# EAGLE design POE_Power_Supply (EAGLE 9.6.2)
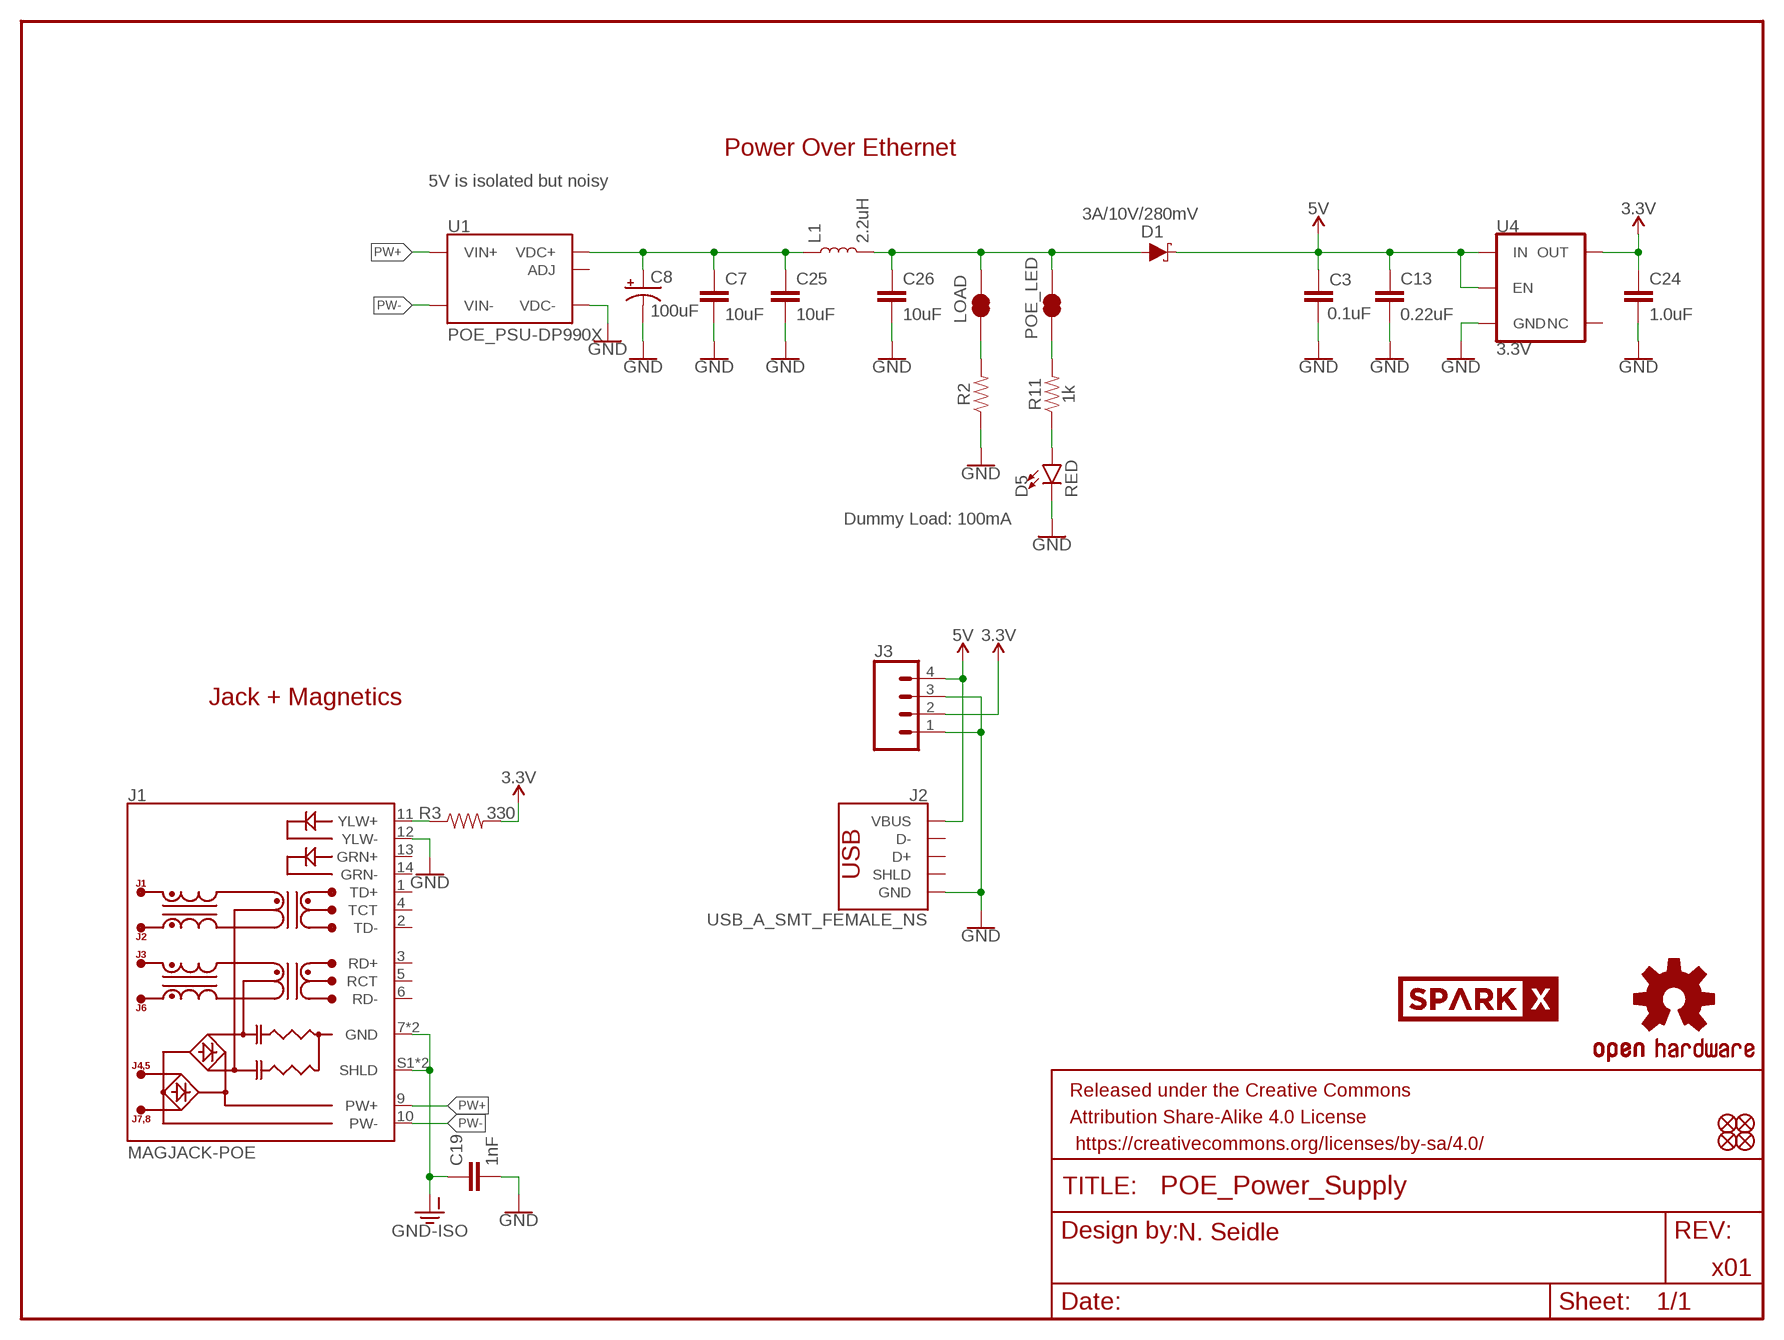
[diagram p0: schematic, sheet 1]

## Parts
C3  0.1uF  0.1UF-0603-25V-(+80/-20%)  [0603]
C7  10uF  10UF-0805-25V-10%  [0805]
C8  100uF  100UF-POLAR-25V-20%(ELEC)  [PANASONIC_D]
C13  0.22uF  0.22UF-0603-25V-10%  [0603]
C19  1nF  1.0NF/1000PF-1206-2KV-10%  [1206]
C24  1.0uF  1.0UF-0603-16V-10%-X7R  [0603]
C25  10uF  10UF-0805-25V-10%  [0805]
C26  10uF  10UF-0805-25V-10%  [0805]
D1  3A/10V/280mV  DIODE-SCHOTTKY-BAT60A  [SOD-323]
D5  RED  LED-RED0603  [LED-0603]
FD1  FIDUCIALUFIDUCIAL  [FIDUCIAL-MICRO]
FD2  FIDUCIALUFIDUCIAL  [FIDUCIAL-MICRO]
FD3  FIDUCIALUFIDUCIAL  [FIDUCIAL-MICRO]
FD4  FIDUCIALUFIDUCIAL  [FIDUCIAL-MICRO]
FRAME1  FRAME-LETTER  [CREATIVE_COMMONS]
J1  MAGJACK-POE  [MAGJACK-SYM_LED]
J2  USB_A_SMT_FEMALE_NS  [USB-A-S-NOSILK-FEMALE]
J3  CONN_041X04_NO_SILK  [1X04_NO_SILK]
L1  2.2uH  INDUCTOR-0805_WIDE-2.2UH  [0805-WIDE]
LOAD  JUMPER-SMT_2_NC_TRACE_SILK  [SMT-JUMPER_2_NC_TRACE_SILK]
LOGO3  OSHW-LOGOMINI  [OSHW-LOGO-MINI]
POE_LED  JUMPER-SMT_2_NC_TRACE_SILK  [SMT-JUMPER_2_NC_TRACE_SILK]
R2  49.9OHM-1206-1/2W-1%  [1206]
R3  330  330OHM-0603-1/10W-1%  [0603]
R11  1k  1KOHM-0603-1/10W-1%  [0603]
U1  POE_PSU-DP990X  [DP990X]
U4  3.3V  V_REG_AP2112K-3.3V  [SOT23-5]
U$7  SPARKX-LOGO4  [SPARKX-MEDIUM]

## Nets
3.3V: C24.1 J3.2 R3.2 U4.5(OUT)
5V: C3.1 C13.1 D1.C J2.VBUS J3.4 U4.1(IN) U4.3(EN)
5V_FILTER: C26.1 D1.A L1.2 LOAD.2 POE_LED.2
5V_RAW: C7.1 C8.+ C25.1 L1.1 U1.1(VDC+) U1.2(VDC+)
GND: C3.2 C7.2 C8.- C13.2 C19.2 C24.2 C25.2 C26.2 D5.C J1.12(YLW-) J2.GND J3.1 J3.3 R2.1 U1.3(VDC-) U4.2(GND)
GND-ISO: C19.1 J1.7(GND) J1.8(GND) J1.S1(SHLD) J1.S2(SHLD)
N$5: D5.A R11.1
N$6: POE_LED.1 R11.2
N$9: LOAD.1 R2.2
N$10: J1.11(YLW+) R3.1
PW+: J1.9(PW+) U1.5(VIN+) U1.6(VIN+)
PW-: J1.10(PW-) U1.7(VIN-) U1.8(VIN-)
Unconnected: J1.1(TD+) J1.2(TD-) J1.3(RD+) J1.4(TCT) J1.5(RCT) J1.6(RD-) J1.13(GRN+) J1.14(GRN-) J2.D+ J2.D- J2.SHLD1(SHLD) J2.SHLD2(SHLD) U1.4(ADJ) U4.4(NC)

## Notes on the sheet
- Power Over Ethernet
- 5V is isolated but noisy
- Dummy Load: 100mA
- Jack + Magnetics
- N. Seidle
- x01

## Library data of the parts
C3 = SparkFun-Capacitors:0.1UF: 0.1µF ceramic capacitors A capacitor is a passive two-terminal electrical component used to store electrical energy temporarily in an electric field.; PROD_ID: CAP-00810
C7 C25 C26 = SparkFun-Capacitors:10UF: 10.0µF ceramic capacitors A capacitor is a passive two-terminal electrical component used to store electrical energy temporarily in an electric field.; PROD_ID: CAP-14259
C8 = SparkFun-Capacitors:100UF-POLAR: 100µF polarized capacitors A capacitor is a passive two-terminal electrical component used to store electrical energy temporarily in an electric field.; PROD_ID: CAP-12547
C13 = SparkFun-Capacitors:0.22UF: 0.22µF ceramic capacitors A capacitor is a passive two-terminal electrical component used to store electrical energy temporarily in an electric field.; PROD_ID: CAP-07822
C19 = SparkFun-Capacitors:1.0NF/1000PF: 1nF/1,000pF ceramic capacitors A capacitor is a passive two-terminal electrical component used to store electrical energy temporarily in an electric field.; PROD_ID: CAP-16238
C24 = SparkFun-Capacitors:1.0UF: 1µF ceramic capacitors A capacitor is a passive two-terminal electrical component used to store electrical energy temporarily in an electric field.; PROD_ID: CAP-13930
D1 = SparkFun-DiscreteSemi:DIODE-SCHOTTKY: Schottky diode A Schottky diode is a semiconductor diode which has a low forward voltage drop and a very fast switching action.; PROD_ID: DIO-14072
D5 = SparkFun-LED:LED-RED: Red SMD LED Used in manufacturing of most products at SparkFun Packages: 0603 - SMD 0603 package [Product Link] <http://docs.avagotech.com/docs/AV02-0551EN> 0603 SMART - SMD 0603 SMART package ( more efficient and expensive)[Product Link] <http://www.osram-os.com/Graphics/XPic2/00077099_0.pdf> 1206 - SMD1206 package [Product Link] <https://www.sparkfun.com/datasheets/DevTools/LilyPad/Q150OVS4.pdff> SparkFun Products: Pro Mini 328 -5V <https://www.sparkfun.com/products/821> RedBoard <https://www.sparkfun.com/products/12757> IOIO-OTG <https://www.sparkfun.com/products/13613>; PROD_ID: DIO-00819
FD1-FD4 = SparkFun-Aesthetics:FIDUCIAL: Fiducial Alignment Points Point-of-reference for pick-and-place machines and other optical instruments.
FRAME1 = SparkFun-Aesthetics:FRAME-LETTER: Schematic Frame - Letter Standard 8.5x11 US Letter frame
J1 = SparkFun-Connectors:MAGJACK-POE: MAGJACK: RJ-45 with POE and LEDs This is a single port, RJ45 ethernet jacks with built in transformer (magnetics), PoE rectifier diodes, status LEDs, and shielding.; PROD_ID: CONN-16253
J2 = SparkFun-Connectors:USB_A: USB-A Connector Male and female variants, as well as PTH and SMT variants SparkFun Products: SparkFun XBee Explorer Dongle <https://www.sparkfun.com/products/11697> PTH Male SparkFun MicroView-USB Programmer <https://www.sparkfun.com/products/12924> SMT Male SparkFun USB Type A Female Breakout <https://www.sparkfun.com/products/12700> SMT Female; PROD_ID: CONN-09520; SF_ID: PRT-09011
J3 = SparkFun-Connectors:CONN_04: Multi connection point. Often used as Generic Header-pin footprint for 0.1 inch spaced/style header connections On any of the 0.1 inch spaced packages, you can populate with these: Break Away Headers - Straight <https://www.sparkfun.com/products/116> (PRT-00116) Break Away Male Headers - Right Angle <https://www.sparkfun.com/products/553> (PRT-00553) Female Headers <https://www.sparkfun.com/products/115> (PRT-00115) Break Away Headers - Machine Pin <https://www.sparkfun.com/products/117> (PRT-00117) Break Away Female Headers - Swiss Machine Pin <https://www.sparkfun.com/products/743> (PRT-00743) For SCREWTERMINALS and SPRING TERMINALS visit here: Screw Terimnals on SparkFun.com <https://www.sparkfun.com/search/results?term=Screw+Terminals> (5mm/3.5mm/2.54mm spacing) This device is also useful as a general connection point to wire up your design to another part of your project. Our various solder wires solder well into these plated through hole pads. Hook-Up Wire - Assortment (Stranded, 22 AWG) <https://www.sparkfun.com/products/11375> (PRT-11375) Hook-Up Wire - Assortment (Solid Core, 22 AWG) <https://www.sparkfun.com/products/11367> (PRT-11367) View the entire wire category on our website here <https://www.sparkfun.com/categories/141> Special notes: Molex polarized connector foot print use with SKU : PRT-08231 with associated crimp pins and housings. 1MM SMD Version SKU: PRT-10208; PROD_ID: CONN-09696
L1 = SparkFun-Coils:INDUCTOR: Inductors Resist changes in electrical current. Basically a coil of wire. SparkFun Products: SparkFun Load Cell Amplifier - HX711 <https://www.sparkfun.com/products/13879> IOIO-OTG - V2.2 <https://www.sparkfun.com/products/13613>; PROD_ID: NDUC-14234
LOAD POE_LED = SparkFun-Jumpers:JUMPER-SMT_2_NC_TRACE: Normally closed trace jumper This jumper has a trace between two pads so it's normally closed (NC). Use a razor knife to open the connection. For best results follow the IPC guidelines for cutting traces: Cutout at least 0.063 mm (0.005 in). Remove all loose material to clean up the cut area. Seal the cut with an approved epoxy. Reapply solder to reclose the connection.
LOGO3 = SparkFun-Aesthetics:OSHW-LOGO: Open-Source Hardware (OSHW) Logo This logo indicates the piece of hardware it is found on incorporates a OSHW license and/or adheres to the definition of open source hardware found here: http://freedomdefined.org/OSHW
R2 = SparkFun-Resistors:49.9OHM: 49.9Ω resistor A resistor is a passive two-terminal electrical component that implements electrical resistance as a circuit element. Resistors act to reduce current flow, and, at the same time, act to lower voltage levels within circuits. - Wikipedia; PROD_ID: RES-16252
R3 = SparkFun-Resistors:330OHM: 330Ω resistor A resistor is a passive two-terminal electrical component that implements electrical resistance as a circuit element. Resistors act to reduce current flow, and, at the same time, act to lower voltage levels within circuits. - Wikipedia; PROD_ID: RES-00818
R11 = SparkFun-Resistors:1KOHM: 1kΩ resistor A resistor is a passive two-terminal electrical component that implements electrical resistance as a circuit element. Resistors act to reduce current flow, and, at the same time, act to lower voltage levels within circuits. - Wikipedia; PROD_ID: RES-07856
U1 = SparkFun-IC-Power:POE_PSU: A special function Power Over Ethernet module with 5V or 12V output. Comes in an SMD package.; PROD_ID: IC-16251
U4 = SparkFun-IC-Power:V_REG_AP2112: AP2112 - 600mA CMOS LDO Regulator w/ Enable The AP2112 is CMOS process low dropout linear regulator with enable function, the regulator delivers a guaranteed 600mA (min.) continuous load current. Features Output Voltage Accuracy: ±1.5% Output Current: 600mA (Min.) Foldback Short Current Protection: 50mA Enable Function to Turn ON/OFF VOUT Low Dropout Voltage (3.3V): 250mV (Typ.) @IOUT=600mA Excellent Load Regulation: 0.2%/A (Typ.) Excellent Line Regulation: 0.02%/V (Typ.) Low Quiescent Current: 55μA (Typ.) Low Standby Current: 0.01μA (Typ.) Low Output Noise: 50μVRMS PSRR: 100Hz -65dB, 1kHz -65dB OTSD Protection Stable with 1.0μF Flexible Cap: Ceramic, Tantalum and Aluminum Electrolytic Operation Temperature Range: -40°C to 85°C ESD: MM 400V, HBM 4000V; PROD_ID: VREG-12457
U$7 = SparkX:SPARKX-LOGO

## Net classes
0 default: width 0 mm, drill 0 mm
1 vcc: width 0 mm

## Board
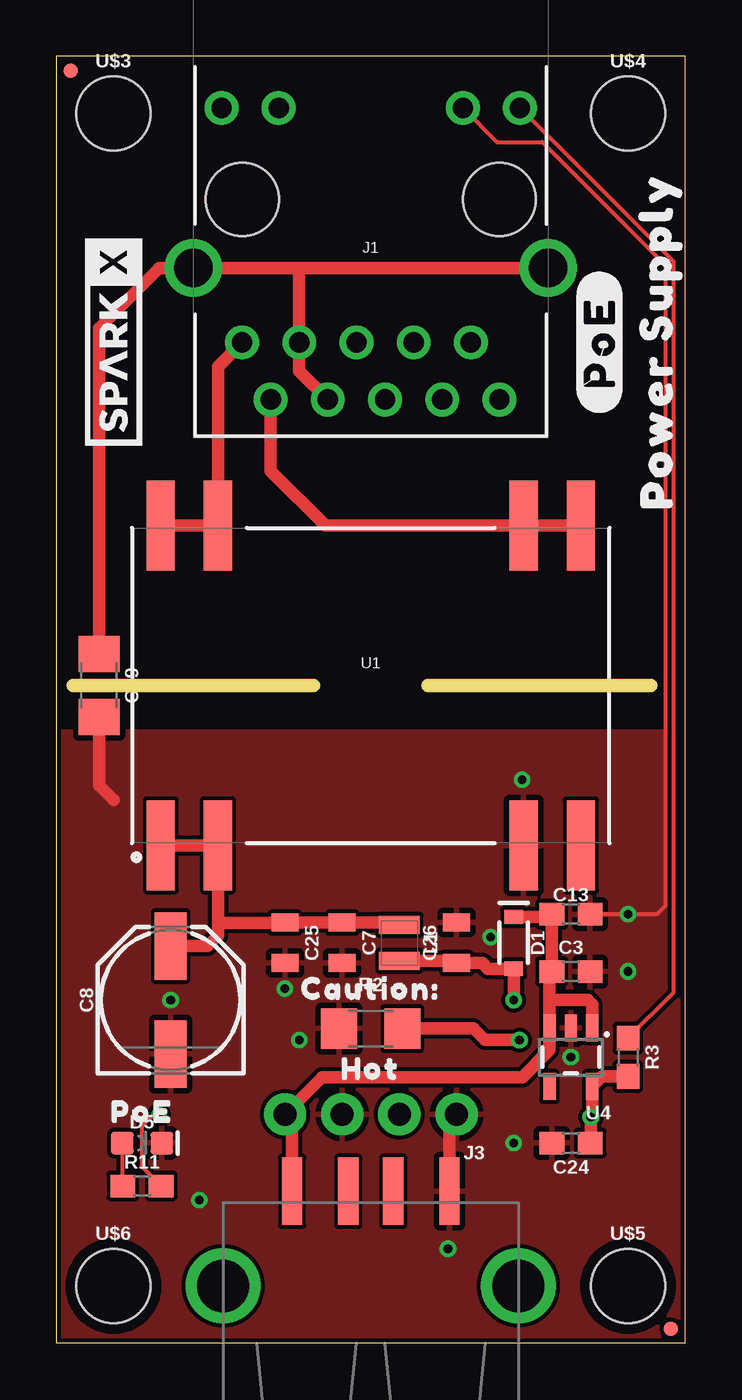
[diagram p1: board, top side]
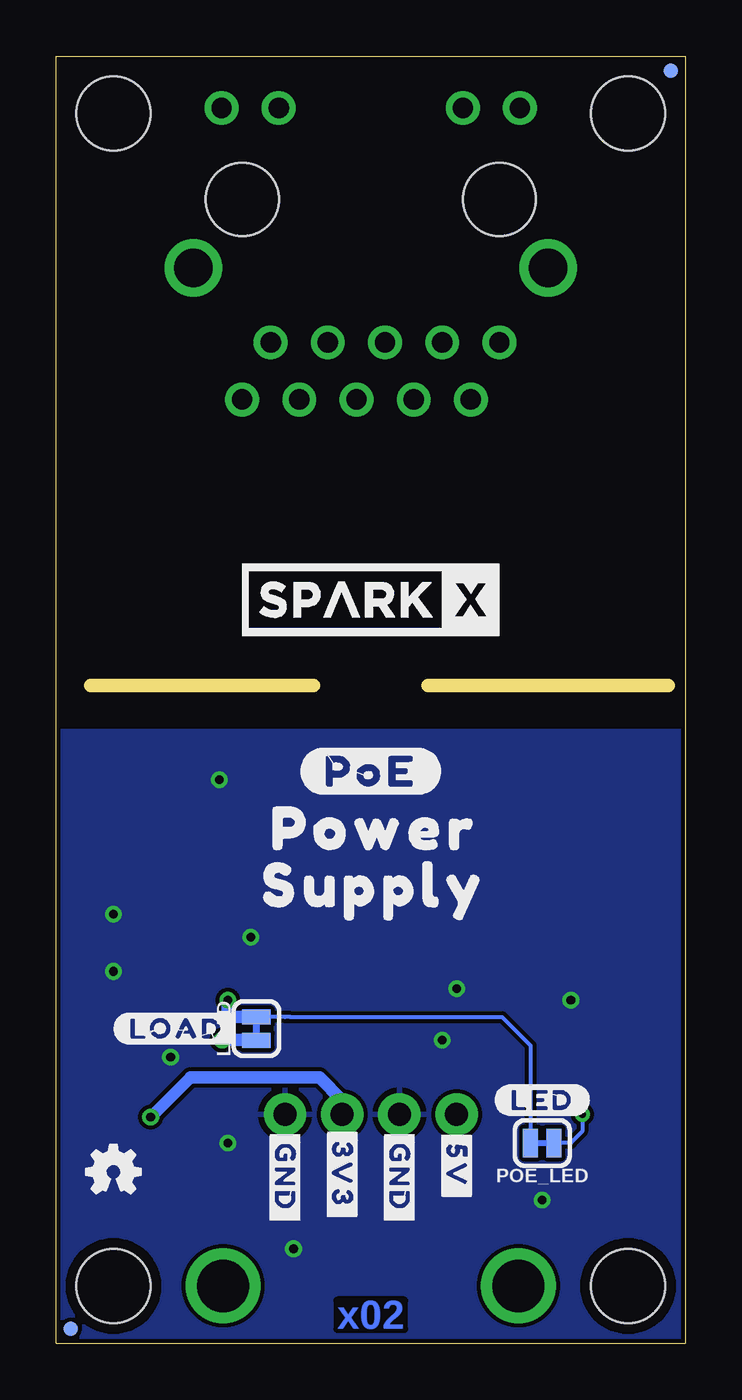
[diagram p2: board, bottom side, seen from below]

Size 27.94 x 57.15 mm. Coordinates in mm from the lower left corner, seen from the top.
Outline: 27.94,0 27.94,57.15 0,57.15 0,0 27.94,0
Copper layers (1*16): Top/Horz 0.035mm / dielectric 1.5mm / Bottom/Vert 0.035mm
Design rules "SparkFun-2-layer-TIGHT *": minimum track width 7mil, minimum drill 12mil, track to track 7mil, track to pad 7mil, pad to pad 7mil, via to via 7mil, smd to smd 7mil, copper to edge 7mil, drill to drill 7mil, minimum pad ring 7mil, minimum via ring 7mil, stop-mask expansion 4mil, vias tented up to drill 25mil, thermal gap 10mil
Milling: 2 lines

### Footprints (pad centres in the part's own frame; a part is rotated, then mirrored left to right if it is on the bottom)
0603 = smd 1.1 x 1: 1 -0.85,0; 2 0.85,0
0805 = smd 0.8 x 1.2: 1 -0.9,0; 2 0.9,0
PANASONIC_D = smd 3 x 1.4: + 2.4,0; - -2.4,0
1206 = smd 1.6 x 1.8: 1 -1.4,0; 2 1.4,0
SOD-323 = smd 0.63 x 0.83: A 1.15,0; C -1.15,0
LED-0603 = smd 1 x 1: A -0.877,0; C 0.877,0
FIDUCIAL-MICRO = smd 0.635 x 0.635: 1 0,0
MAGJACK-SYM_LED = drill 0.9 pad 1.5: 1 -5.715,8.89; 2 -4.445,6.35; 3 -3.175,8.89; 4 -1.905,6.35; 5 -0.635,8.89; 6 0.635,6.35; 7 1.905,8.89; 8 3.175,6.35; 9 4.445,8.89; 10 5.715,6.35; 11 -6.63,-4.06; 12 -4.09,-4.06; 13 4.09,-4.06; 14 6.63,-4.06 | drill 1.7 pad 2.4: S1 -7.875,3.05; S2 7.875,3.05 | hole 3.25: -5.715,0; 5.715,0
USB-A-S-NOSILK-FEMALE = smd 3 x 0.9: D+ 6.752,-1; D- 6.752,1; GND 6.752,-3.5; VBUS 6.752,3.5 | drill 2.311: SHLD1 2.54,-6.566; SHLD2 2.54,6.566
1X04_NO_SILK = drill 1.016 pad 1.88: 1 0,0; 2 2.54,0; 3 5.08,0; 4 7.62,0
0805-WIDE = smd 0.8 x 1.8: 1 -0.8,0; 2 0.8,0
SMT-JUMPER_2_NC_TRACE_SILK = smd 0.66 x 1.27: 1 -0.521,0; 2 0.521,0
DP990X = smd 1.25 x 4: 1 -9.33,-7.1; 2 -6.79,-7.1; 3 6.79,-7.1; 4 9.33,-7.1; 5 9.33,7.1; 6 6.79,7.1; 7 -6.79,7.1; 8 -9.33,7.1
SOT23-5 = smd 0.55 x 1.2: 1 -0.95,-1.3; 2 0,-1.3; 3 0.95,-1.3; 4 0.95,1.3; 5 -0.95,1.3
STAND-OFF = hole 3.302: 0,0

### Placement (x,y rotation side)
C3  22.86,16.51 0 top
C7  12.7,17.78 270 top
C8  5.08,15.24 90 top
C13  22.86,19.05 0 top
C19  1.91,29.21 270 top
C24  22.86,8.89 180 top
C25  10.16,17.78 270 top
C26  17.78,17.78 90 top
D1  20.32,17.78 270 top
D5  3.81,8.89 0 top
FD1  27.3,0.64 90 top
FD2  0.64,56.52 90 top
FD3  27.3,0.64 270 bottom
FD4  0.64,56.52 270 bottom
FRAME1  -8.89,-20.32 0 top  (outside the outline)
J1  13.97,50.8 180 top
J2  13.97,0 90 top
J3  17.78,10.16 180 top
L1  15.24,17.78 270 top
LOAD  19.05,13.97 90 bottom
LOGO3  25.4,7.62 0 bottom
POE_LED  6.35,8.89 180 bottom
R2  13.97,13.97 0 top
R3  25.4,12.7 270 top
R11  3.81,6.99 0 top
U1  13.97,29.21 0 top
U4  22.86,12.7 180 top
U$1  [#POE#0]  13.97,25.4 0 bottom
U$3  [STAND-OFF]  2.54,54.61 0 top
U$4  [STAND-OFF]  25.4,54.61 0 top
U$5  [STAND-OFF]  25.4,2.54 0 top
U$6  [STAND-OFF]  2.54,2.54 0 top
U$7  2.54,44.45 90 top
U$8  [#LED#0]  6.35,10.79 0 bottom
U$9  [#LOAD#0]  22.61,13.97 0 bottom
U$10  [#3V3#0]  15.24,7.49 270 bottom
U$11  [#5V#2]  10.16,7.87 270 bottom
U$12  [#GND#1]  12.7,7.37 270 bottom
U$13  [#GND#1]  17.78,7.37 270 bottom
U$14  [CAUTION#0]  13.97,15.75 0 top
U$15  [HOT1]  13.97,12.19 0 top
U$16  [POE0]  3.81,10.29 0 top
U$17  [POWER_0]  13.46,22.86 0 bottom
U$18  [#POE#0]  24.13,44.45 90 top
U$19  SPARKX-LOGO4  [SPARKX-LARGE]  13.97,33.02 0 bottom
U$20  [POWER0]  26.67,40.51 90 top
U$21  [SUPPLY1]  26.67,48.26 90 top
U$22  [SUPPLY_1]  13.46,20.32 0 bottom

### Tracks (layer width: path | path; a pad name or v marks a point on that pad's centre or on a via)
3.3V  (via drill 0.38)
  Top/Horz 0.559: R3.2 24.26,11.85 U4.5 23.81,10.16 23.81,10.09 v23.75,10.03 23.75,8.93 C24.1
  Bottom/Vert 0.559: J3.2 15.24,10.79 16.26,11.81 21.97,11.81 v23.75,10.03
5V
  Top/Horz 0.559: D1.C 21.89,18.93 C13.1 C3.1 21.91,16.41 21.91,15.24 | U4.1 23.81,15.05 23.62,15.24 21.91,15.24 | 21.91,15.24 U4.3 21.91,13.02 20.7,11.81 11.81,11.81 J3.4 10.47,9.85 J2.VBUS
5V_FILTER  (via drill 0.38)
  Top/Horz 0.559: L1.2 17.68,16.98 C26.1 18.93,16.88 19.18,16.63 D1.A v20.32,15.24
  Bottom/Vert 0.178: LOAD.2 17.78,14.49 17.54,14.49 8.14,14.49 6.87,13.22 POE_LED.2
  Bottom/Vert 0.559: v20.32,15.24 20.32,14.73 20.08,14.49 LOAD.2
5V_RAW
  Top/Horz 0.559: 7.18,18.67 U1.2 U1.1 | 7.18,18.67 7.18,18.1 6.72,17.64 C8.+ | 7.18,18.67 10.15,18.67 C25.1 C7.1 15.14,18.68 L1.1
GND  (via drill 0.38)
  Top/Horz 0.178: J1.12 19.58,53.34 21.59,53.34 27.04,47.89 27.04,19.42 26.67,19.05 C13.2
  Top/Horz 0.559: J2.GND 17.47,9.85 J3.1 | C19.2 1.91,24.77 2.54,24.13
  other vias: 22.86,12.7 5.08,15.24 6.35,6.35 10.16,15.75 10.79,13.46 19.3,18.03 25.4,16.51 25.4,19.05 20.32,8.89 17.4,4.19 20.7,25.02
  pour Top/Horz (isolate 0.178): 0,27.18 27.94,27.18 27.94,0 0,0
  pour Bottom/Vert (isolate 0.178): 0,27.18 27.94,27.18 27.94,0 0,0
GND-ISO
  Top/Horz 0.559: 10.79,47.75 J1.S2 4.57,47.75 1.91,45.09 C19.1 | 10.79,47.75 J1.S1 | 10.79,47.75 J1.8 10.79,43.18 J1.7
N$5
  Top/Horz 0.178: D5.A 2.93,7.01 R11.1
N$6  (via drill 0.3)
  Top/Horz 0.178: v4.57,10.16 4.32,10.16 3.81,9.65 3.81,7.83 R11.2
  Bottom/Vert 0.178: v4.57,10.16 4.57,9.4 5.08,8.89 POE_LED.1
N$9  (via drill 0.38)
  Top/Horz 0.559: v20.57,13.46 19.05,13.46 18.54,13.97 R2.2
  Bottom/Vert 0.559: LOAD.1 19.06,13.46 v20.57,13.46
N$10
  Top/Horz 0.178: R3.1 27.4,15.55 27.4,48.06 J1.11
PW+
  Top/Horz 0.559: J1.9 9.53,38.73 11.95,36.31 U1.6 U1.5
PW-
  Top/Horz 0.559: J1.10 7.18,43.38 U1.7 U1.8

### Text on the board
Bottom/Vert: x02
tDocu: N. Seidle